# EAGLE design KMO_IO_MV4 (EAGLE 9.1.3)

## Sheet 1 of 2
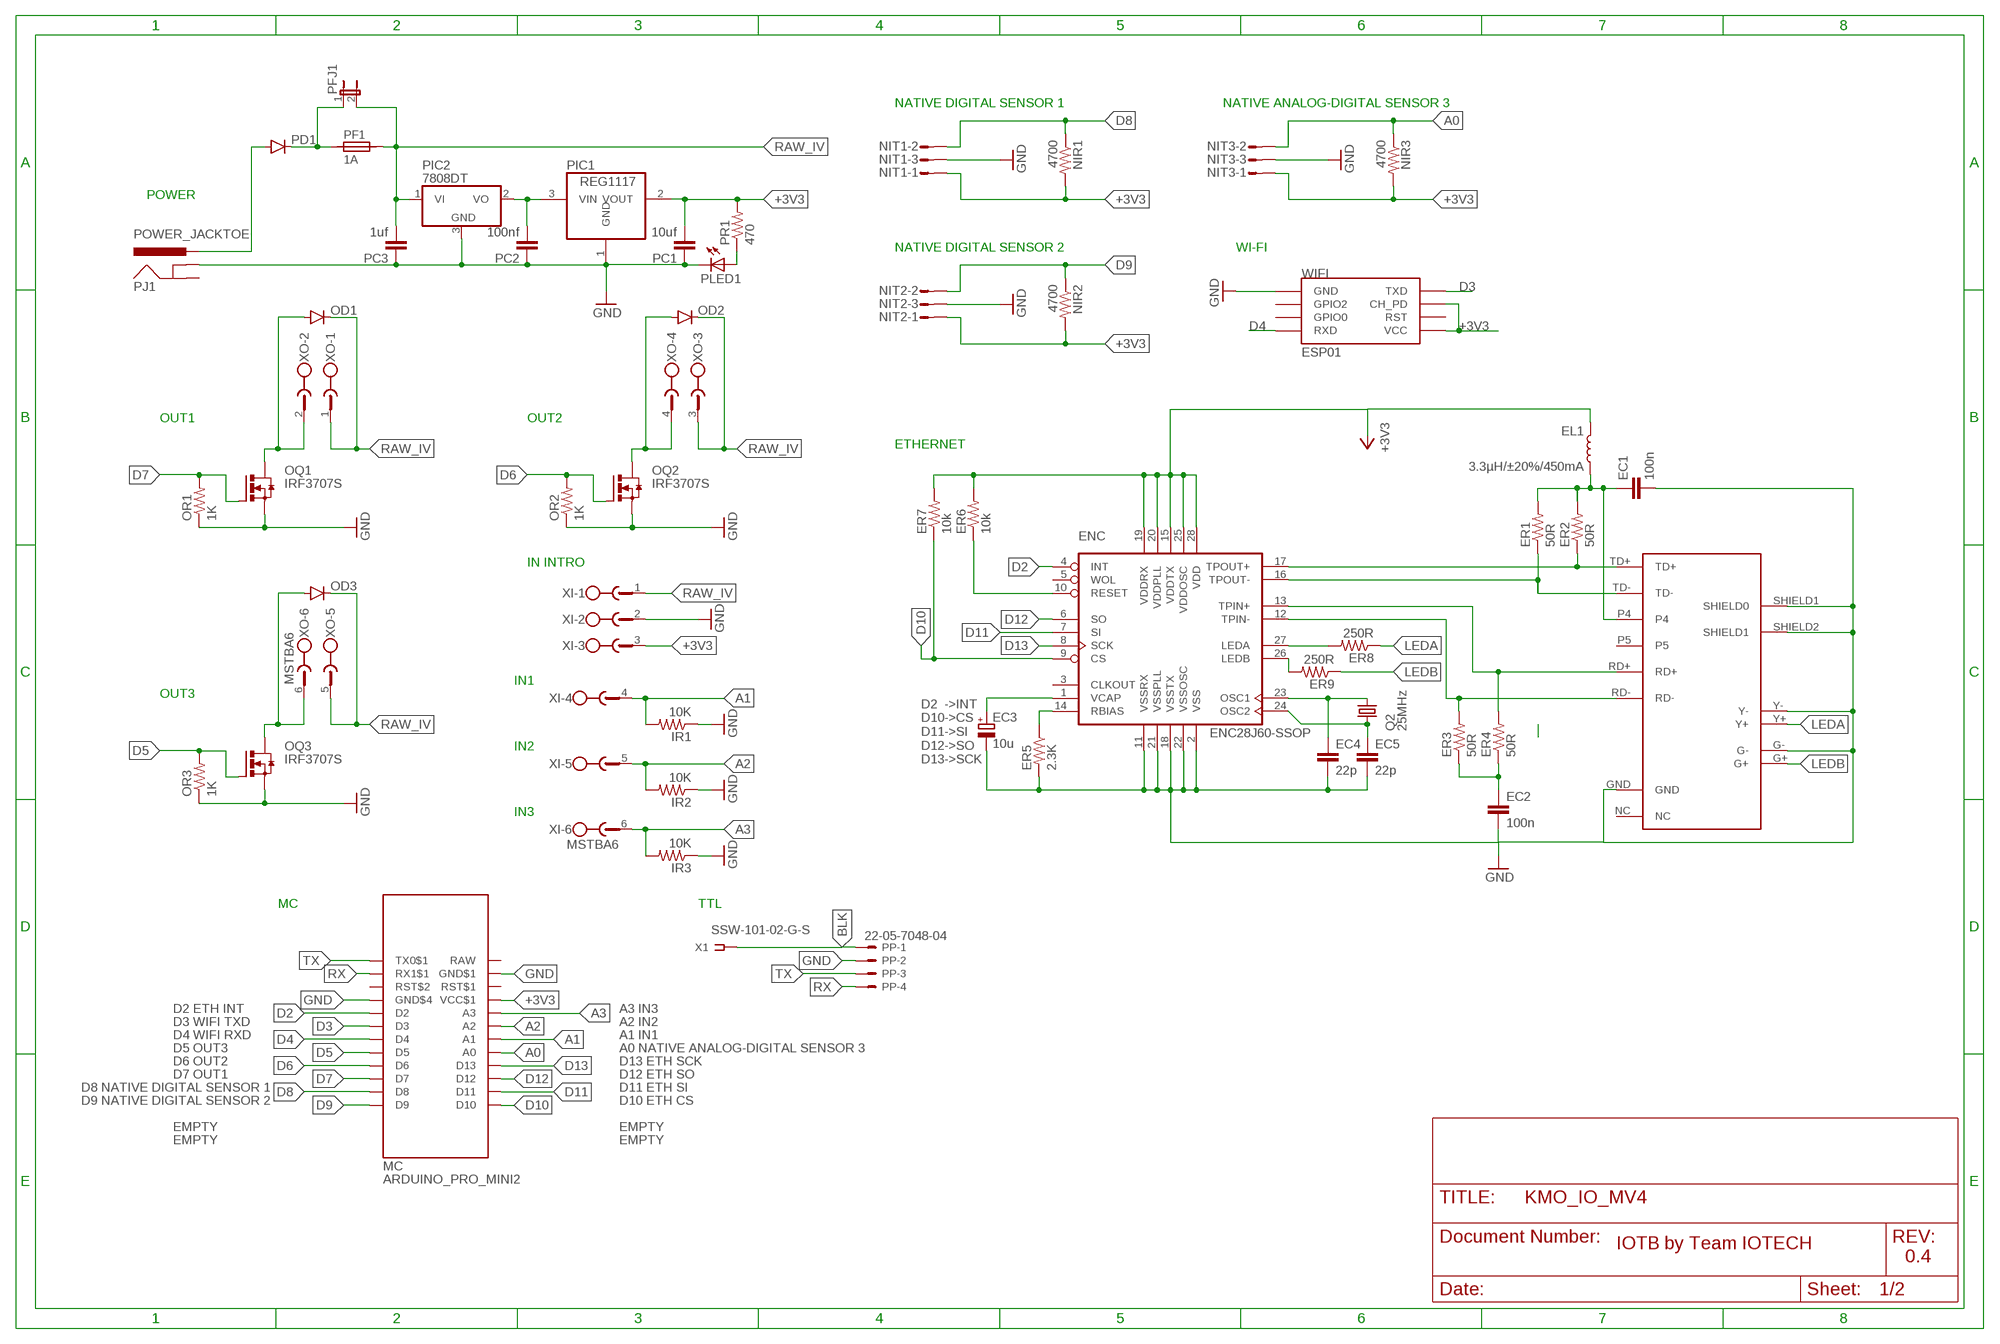
[diagram p0: schematic, sheet 1]

### Parts
EC1  100n  CAP0805  [0805]
EC2  100n  CAP0805  [0805]
EC3  10u  CPOL-EUSANYO_SMD_B6  [SANYO-OSCON_SMD_B6]
EC4  22p  CAP0805  [0805]
EC5  22p  CAP0805  [0805]
EL1  3.3µH/±20%/450mA  INDUCTOR-0805-3.3UH  [0805]
ENC  ENC28J60-SSOP  [SSOP28]
ER1  50R  RESISTOR0805-RES  [0805]
ER2  50R  RESISTOR0805-RES  [0805]
ER3  50R  RESISTOR0805-RES  [0805]
ER4  50R  RESISTOR0805-RES  [0805]
ER5  2.3K  RESISTOR0805-RES  [0805]
ER6  10k  RESISTOR0805-RES  [0805]
ER7  10k  RESISTOR0805-RES  [0805]
ER8  250R  RESISTOR0805-RES  [0805]
ER9  250R  RESISTOR0805-RES  [0805]
IR1  10K  RESISTOR0805-RES  [0805]
IR2  10K  RESISTOR0805-RES  [0805]
IR3  10K  RESISTOR0805-RES  [0805]
MC  ARDUINO_PRO_MINI2  [ARDUINO_PRO_MINI2]
NIR1  4700  RESISTOR0805-RES  [0805]
NIR2  4700  RESISTOR0805-RES  [0805]
NIR3  4700  RESISTOR0805-RES  [0805]
NIT1  S03P  [S03P]
NIT2  S03P  [S03P]
NIT3  S03P  [S03P]
OD1  DIODESMA  [SMA-DIODE]
OD2  DIODESMA  [SMA-DIODE]
OD3  DIODESMA  [SMA-DIODE]
OQ1  IRF3707S  IRF3704S  [D2PACK]
OQ2  IRF3707S  IRF3704S  [D2PACK]
OQ3  IRF3707S  IRF3704S  [D2PACK]
OR1  1K  RESISTOR0805-RES  [0805]
OR2  1K  RESISTOR0805-RES  [0805]
OR3  1K  RESISTOR0805-RES  [0805]
PC1  10uf  CAP0805  [0805]
PC2  100nf  CAP0805  [0805]
PC3  1uf  CAP0805  [0805]
PD1  DIODESMA  [SMA-DIODE]
PF1  1A  SIBA194600  [1820]
PFJ1  JP1E  [JP1]
PIC1  REG1117  [SOT223]
PIC2  7808DT  [TO252]
PJ1  POWER_JACKTOE  [POWER_JACK_SMD_OVERPASTE_TOE]
PLED1  LEDCHIP-LED0805  [CHIP-LED0805]
PP  22-05-7048-04  [7395-04]
PR1  470  RESISTOR0805-RES  [0805]
Q2  25MHz  CRYSTALHC49S  [HC49/S]
U$2  HR911105A  [RJ45]
WIFI  ESP01  [ESP01]
X1  SSW-101-02-G-S  [SSW-101-02-G-S]
XI  MSTBA6  [MSTBA6]
XO  MSTBA6  [MSTBA6]

### Nets
+3V3: EL1.1 ENC.15(VDDTX) ENC.19(VDDRX) ENC.20(VDDPLL) ENC.25(VDDOSC) ENC.28(VDD) ER6.2 ER7.2 MC.VCC$1 NIR1.2 NIR2.2 NIR3.2 NIT1.1 NIT2.1 NIT3.1 PC1.2 PIC1.2(VOUT) PR1.2 WIFI.CH_PD WIFI.VCC XI.3
A0: MC.A0 NIR3.1 NIT3.2
A1: IR1.2 MC.A1 XI.4
A2: IR2.2 MC.A2 XI.5
A3: IR3.2 MC.A3 XI.6
BLK: PP.1 X1.1
D2: ENC.4(INT) MC.D2
D3: MC.D3 WIFI.TX(TXD)
D4: MC.D4 WIFI.RX(RXD)
D5: MC.D5 OQ3.1(G) OR3.2
D6: MC.D6 OQ2.1(G) OR2.2
D7: MC.D7 OQ1.1(G) OR1.2
D8: MC.D8 NIR1.1 NIT1.2
D9: MC.D9 NIR2.1 NIT2.2
D10: ENC.9(CS) ER7.1 MC.D10
D11: ENC.7(SI) MC.D11
D12: ENC.6(SO) MC.D12
D13: ENC.8(SCK) MC.D13
EP4: EC1.1 EL1.2 ER1.2 ER2.2 U$2.P4
GND: EC1.2 EC2.2 EC3.- EC4.2 EC5.2 ENC.2(VSS) ENC.11(VSSRX) ENC.18(VSSTX) ENC.21(VSSPLL) ENC.22(VSSOSC) ER5.2 IR1.1 IR2.1 IR3.1 MC.GDN$1(GND$1) MC.GND$4 NIT1.3 NIT2.3 NIT3.3 OQ1.3(S) OQ2.3(S) OQ3.3(S) OR1.1 OR2.1 OR3.1 PC1.1 PC2.1 PC3.1 PIC1.1(GND) PIC2.3(GND) PJ1.GND(GNDBREAK) PLED1.C PP.2 U$2.G- U$2.GND U$2.SHIELD1(SHIELD0) U$2.SHIELD2(SHIELD1) U$2.Y- WIFI.GND XI.2
LEDA: ER8.1 U$2.Y+
LEDB: ER9.1 U$2.G+
N$1: OD3.A OQ3.2(D) XO.6
N$2: PD1.C PF1.1 PFJ1.1
N$3: OD1.A OQ1.2(D) XO.2
N$4: OD2.A OQ2.2(D) XO.4
N$6: EC2.1 ER3.1 ER4.1
N$7: PD1.A PJ1.VIN0(PWR)
N$9: ENC.27(LEDA) ER8.2
N$11: PLED1.A PR1.1
N$12: PC2.2 PIC1.3(VIN) PIC2.2(VO)
N$13: EC3.+ ENC.1(VCAP)
N$14: ENC.26(LEDB) ER9.2
N$17: ENC.10(RESET) ER6.1
N$19: ENC.14(RBIAS) ER5.1
N$22: EC5.1 ENC.24(OSC2) Q2.1
N$24: EC4.1 ENC.23(OSC1) Q2.2
RAW_IV [v]: OD1.C OD2.C OD3.C PC3.2 PF1.2 PFJ1.2 PIC2.1(VI) XI.1 XO.1 XO.3 XO.5
RD+: ENC.13(TPIN+) ER4.2 U$2.RD+
RD-: ENC.12(TPIN-) ER3.2 U$2.RD-
RX: MC.RX1$1 PP.4
TD+: ENC.17(TPOUT+) ER2.1 U$2.TD+
TD-: ENC.16(TPOUT-) ER1.1 U$2.TD-
TX: MC.TX0$1 PP.3
Unconnected: ENC.3(CLKOUT) ENC.5(WOL) MC.RST$1 MC.RST$2 PJ1.P$4(GND) U$2.NC U$2.P5 WIFI.GPIO0 WIFI.GPIO2 WIFI.RST

### Notes on the sheet
- NATIVE DIGITAL SENSOR 1 | NATIVE ANALOG-DIGITAL SENSOR 3
- POWER
- NATIVE DIGITAL SENSOR 2 | WI-FI
- OUT1 | OUT2
- ETHERNET
- IN INTRO
- IN1
- OUT3
- IN2
- D2  ->INT
  D10->CS
  D11->SI
  D12->SO
  D13->SCK
- IN3
- MC | TTL
- D2 ETH INT | A3 IN3
- D3 WIFI TXD | A2 IN2
- D4 WIFI RXD | A1 IN1
- D5 OUT3 | A0 NATIVE ANALOG-DIGITAL SENSOR 3
- D6 OUT2 | D13 ETH SCK
- D7 OUT1 | D12 ETH SO
- D8 NATIVE DIGITAL SENSOR 1 | D11 ETH SI
- D9 NATIVE DIGITAL SENSOR 2 | D10 ETH CS
- EMPTY | EMPTY
- EMPTY | EMPTY
- IOTB by Team IOTECH
- 0.4

## Sheet 2 of 2
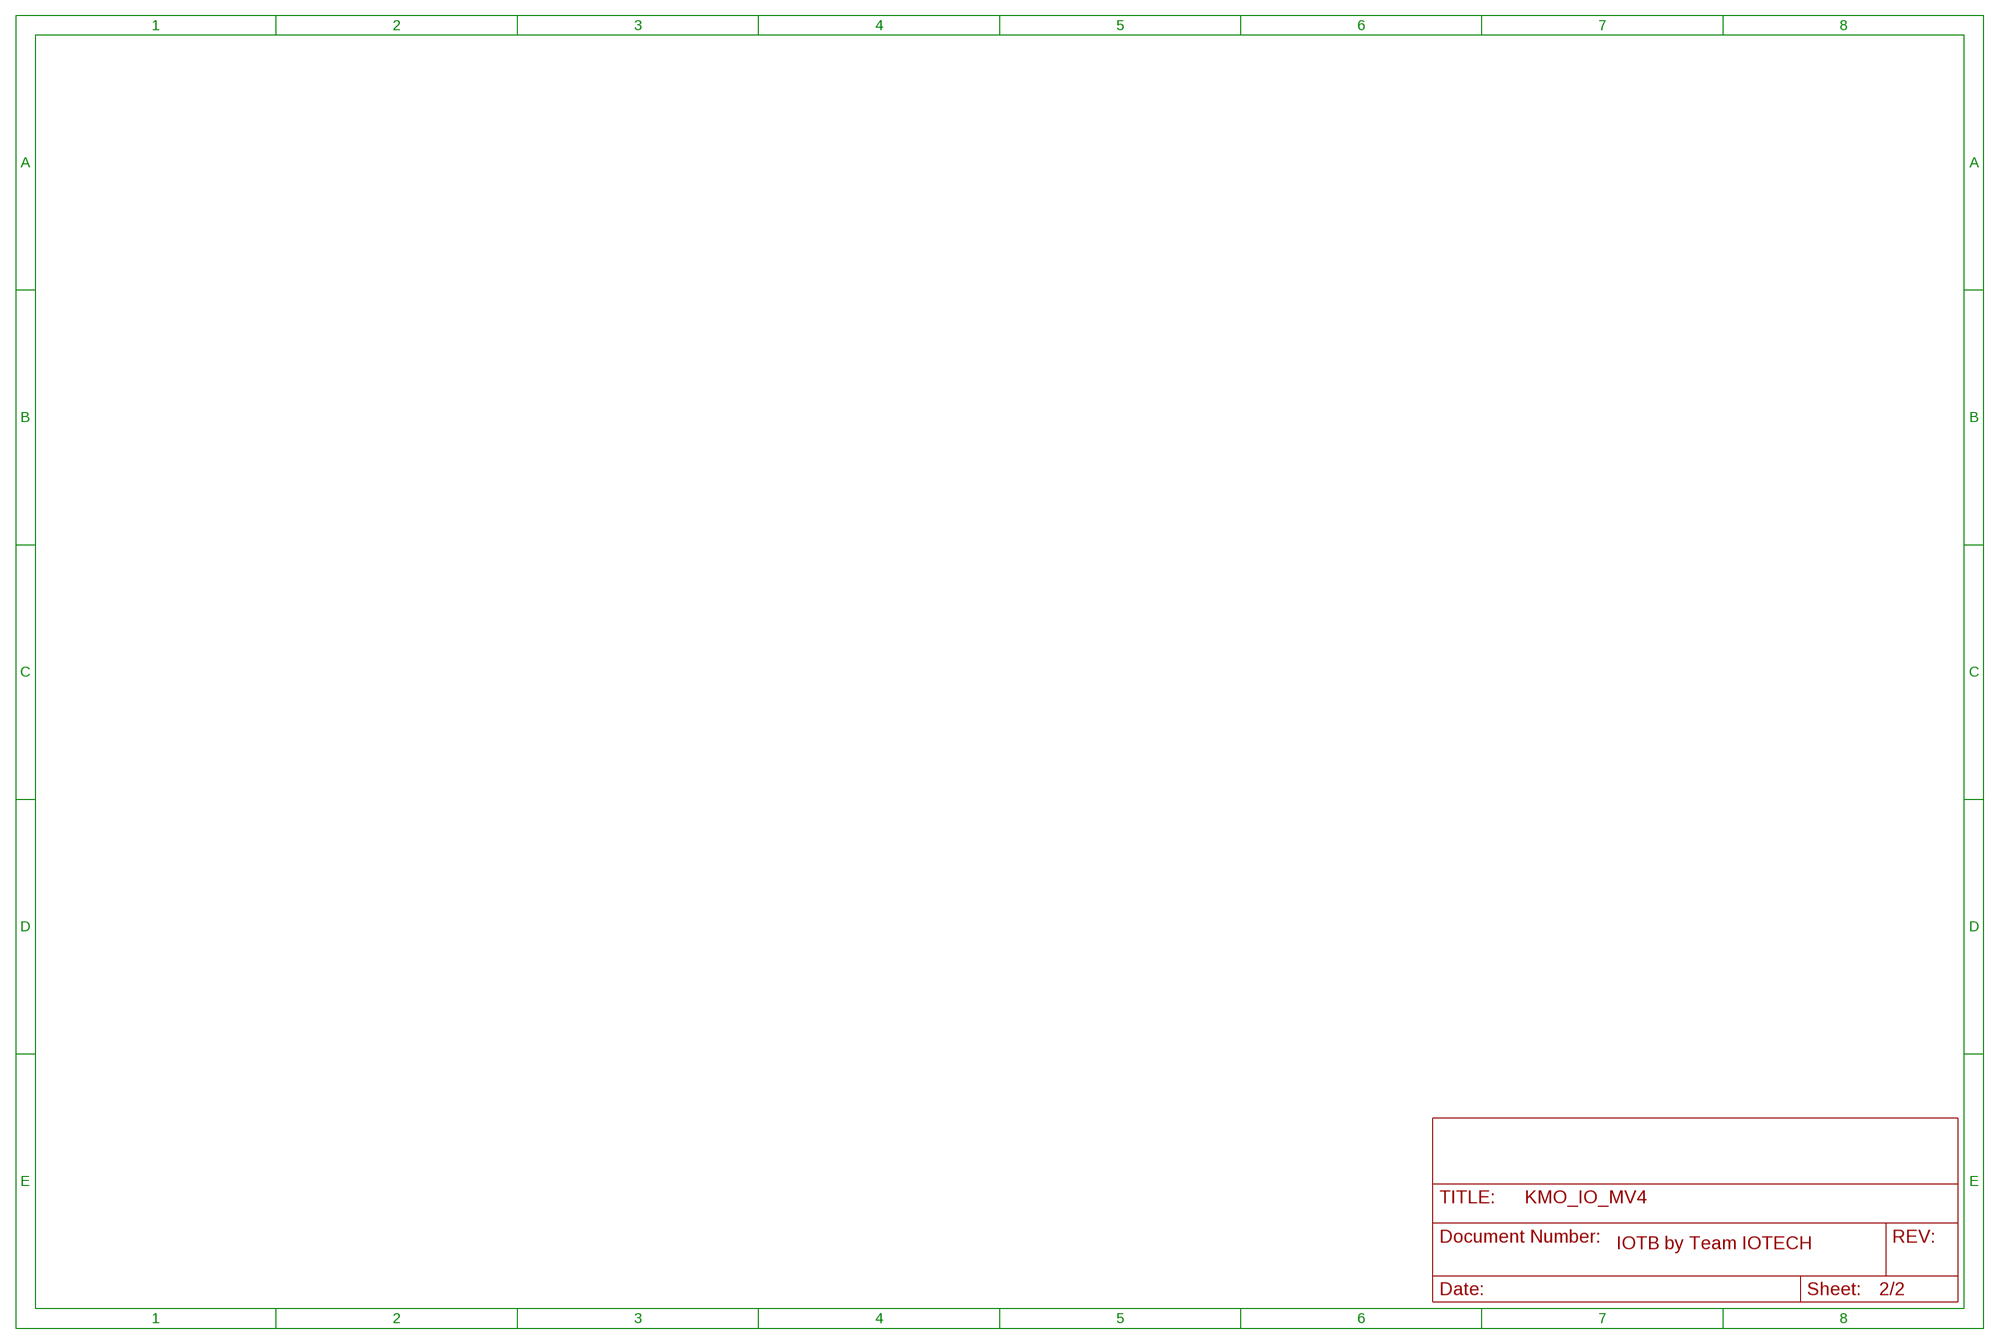
[diagram p1: schematic, sheet 2]

### Notes on the sheet
- IOTB by Team IOTECH

## Power pins joined to a net without a drawn wire
RAW: MC.RAW

## Library data of the parts
EC1 EC2 EC4 EC5 = SparkFun-Passives:CAP: Capacitor Standard 0603 ceramic capacitor, and 0.1" leaded capacitor.
EC3 = rcl:CPOL-EU: POLARIZED CAPACITOR, European symbol; SPICEPREFIX: C
EL1 = SparkFun-Coils:INDUCTOR: Inductors Resist changes in electrical current. Basically a coil of wire. SparkFun Products: SparkFun Load Cell Amplifier - HX711 <https://www.sparkfun.com/products/13879> IOIO-OTG - V2.2 <https://www.sparkfun.com/products/13613>; PROD_ID: NDUC-13076
ENC = microchip-enc28j60:ENC28J60-*: Microchip 10Mbit Eth. contoller with SPI interface
ER1-ER9 IR1-IR3 NIR1-NIR3 OR1-OR3 PR1 = SparkFun-Passives:RESISTOR: Resistor Basic schematic elements and footprints for 0603, 1206, and PTH resistors.
MC = personal_srgPersonal:ARDUINO_PRO_MINI2
NIT1-NIT3 = con-amp-mt:S03P: AMP MT CONNECTOR; OC_FARNELL: unknown; OC_NEWARK: unknown
OD1-OD3 PD1 = SparkFun-DiscreteSemi:DIODE: Diode These are standard reverse protection diodes and small signal diodes. SMA package can handle up to about 1A. SOD-323 can handle about 200mA. What the SOD-323 package when ordering, there are some mfgs out there that are 5-pin packages.
OQ1-OQ3 = transistor-power:IRF3704: SMPS MOSFET HEXFET® Power MOSFET Source: http://www.irf.com/product-info/datasheets/data/irf3704.pdf
PC1-PC3 = SparkFun-Capacitors:CAP: Capacitor Standard 0603 ceramic capacitor, and 0.1" leaded capacitor.
PF1 = _hhn_PtcFuses_Siba_r500_Ozan:SIBA194600*: SIBA PTC-Fuses, Series 194600, 1812 (4.5 3.2)mm Source: www.siba.de/ Package: SMD 1812 (4.5 x 3.2)mm Technologies: SIBA194600Axxx xxx: Trip-Current * 10 mA Author: Dipl.-Ing. FH Rainer Bayer
PFJ1 = jumper:JP1E: JUMPER
PIC1 = burr-brown:REG1117: 800mA and 1A Low Dropout (LDO) Positive Regulator 1.8V, 2.5V, 2.85V, 3.3V, 5V, and Adj; MPN: REG1117; OC_FARNELL: 1097566; OC_NEWARK: 14P6981
PIC2 = linear:78*: Positive VOLTAGE REGULATOR Source: http://cache.national.com/ds/LM/LM78L05.pdf http://www.fairchildsemi.com/ds/LM/LM7805.pdf
PJ1 = SparkFun-Connectors:POWER_JACK: Power Jack Connector This is the standard 5.5mm barrel jack for power. The PTH is the most common, proven, reliable, footprint. The Slot footprint only works if the mill layer is transmitted to the PCB fab house so be warned. Here are the connectors we sell at SparkFun: DC Barrel Power Jack/Connector <https://www.sparkfun.com/products/119> (PRT-00119) DC Barrel Power Jack/Connector (SMD) <https://www.sparkfun.com/products/12748> (PRT-12748) DC Barrel Jack Adapter - Breadboard Compatible <https://www.sparkfun.com/products/10811> (PRT-10811) It is used on this SparkFun product (and many, many others): SparkFun RedBoard - Programmed with Arduino <https://www.sparkfun.com/products/12757> (DEV-12757) Also, if you need a mating power supply or connector, please check these out: Wall Adapter Power Supply - 9VDC 650mA <https://www.sparkfun.com/products/298> (TOL-00298) DC Barrel Jack Adapter - Male <https://www.sparkfun.com/products/10287> (PRT-10287); PROD_ID: CONN-08106; SF_ID: PRT-12748
PLED1 = led:LED: LED OSRAM: - CHIPLED LG R971, LG N971, LY N971, LG Q971, LY Q971, LO R971, LY R971 LH N974, LH R974 LS Q976, LO Q976, LY Q976 LO Q996 - Hyper CHIPLED LW Q18S LB Q993, LB Q99A, LB R99A - SideLED LS A670, LO A670, LY A670, LG A670, LP A670 LB A673, LV A673, LT A673, LW A673 LH A674 LY A675 LS A676, LA A676, LO A676, LY A676, LW A676 LS A679, LY A679, LG A679 - Hyper Micro SIDELED® LS Y876, LA Y876, LO Y876, LY Y876 LT Y87S - SmartLED LW L88C, LW L88S LB L89C, LB L89S, LG L890 LS L89K, LO L89K, LY L89K LS L896, LA L896, LO L896, LY L896 - TOPLED LS T670, LO T670, LY T670, LG T670, LP T670 LSG T670, LSP T670, LSY T670, LOP T670, LYG T670 LG T671, LOG T671, LSG T671 LB T673, LV T673, LT T673, LW T673 LH T674 LS T676, LA T676, LO T676, LY T676, LB T676, LH T676, LSB T676, LW T676 LB T67C, LV T67C, LT T67C, LS T67K, LO T67K, LY T67K, LW E67C LS E67B, LA E67B, LO E67B, LY E67B, LB E67C, LV E67C, LT E67C LW T67C LS T679, LY T679, LG T679 LS T770, LO T770, LY T770, LG T770, LP T770 LB T773, LV T773, LT T773, LW T773 LH T774 LS E675, LA E675, LY E675, LS T675 LS T776, LA T776, LO T776, LY T776, LB T776 LHGB T686 LT T68C, LB T68C - Hyper Mini TOPLED® LB M676 - Mini TOPLED Santana® LG M470 LS M47K, LO M47K, LY M47K Source: http://www.osram.convergy.de LUXEON: - LUMILED® LXK2-PW12-R00, LXK2-PW12-S00, LXK2-PW14-U00, LXK2-PW14-V00 LXK2-PM12-R00, LXK2-PM12-S00, LXK2-PM14-U00 LXK2-PE12-Q00, LXK2-PE12-R00, LXK2-PE12-S00, LXK2-PE14-T00, LXK2-PE14-U00 LXK2-PB12-K00, LXK2-PB12-L00, LXK2-PB12-M00, LXK2-PB14-N00, LXK2-PB14-P00, LXK2-PB14-Q00 LXK2-PR12-L00, LXK2-PR12-M00, LXK2-PR14-Q00, LXK2-PR14-R00 LXK2-PD12-Q00, LXK2-PD12-R00, LXK2-PD12-S00 LXK2-PH12-R00, LXK2-PH12-S00 LXK2-PL12-P00, LXK2-PL12-Q00, LXK2-PL12-R00 Source: www.luxeon.com KINGBRIGHT: KA-3528ASYC Source: www.kingbright.com
PP = con-molex:22-?-04: CONNECTOR wire to board 2.54 mm (.1 inch) pitch header; MF: MOLEX; OC_FARNELL: unknown; OC_NEWARK: unknown
Q2 = crystal:CRYSTAL: CRYSTAL
U$2 = HR911105A:HR911105A
WIFI = esp8266modules:ESP01: ESP8266 Wifi module 01
X1 = con-samtec:SSW-101-02-G-S: THROUGH-HOLE .025" SQ POST SOCKET Source: Samtec SSW.pdf; MF: Samtec Inc.; MPN: SSW-101-02-G-S; OC_FARNELL: unknown; OC_NEWARK: 11P9336
XI XO = con-phoenix-508:MSTBA6: PHOENIX; MF: FARNELL; MPN: 1757284; OC_FARNELL: 3705213; OC_NEWARK: 71C4165

## Net classes
0 default: width 0.3 mm, drill 0.5 mm, clearance 0.25 mm
1 v: width 0.3 mm, drill 0.5 mm, clearance 0.25 mm

## Board
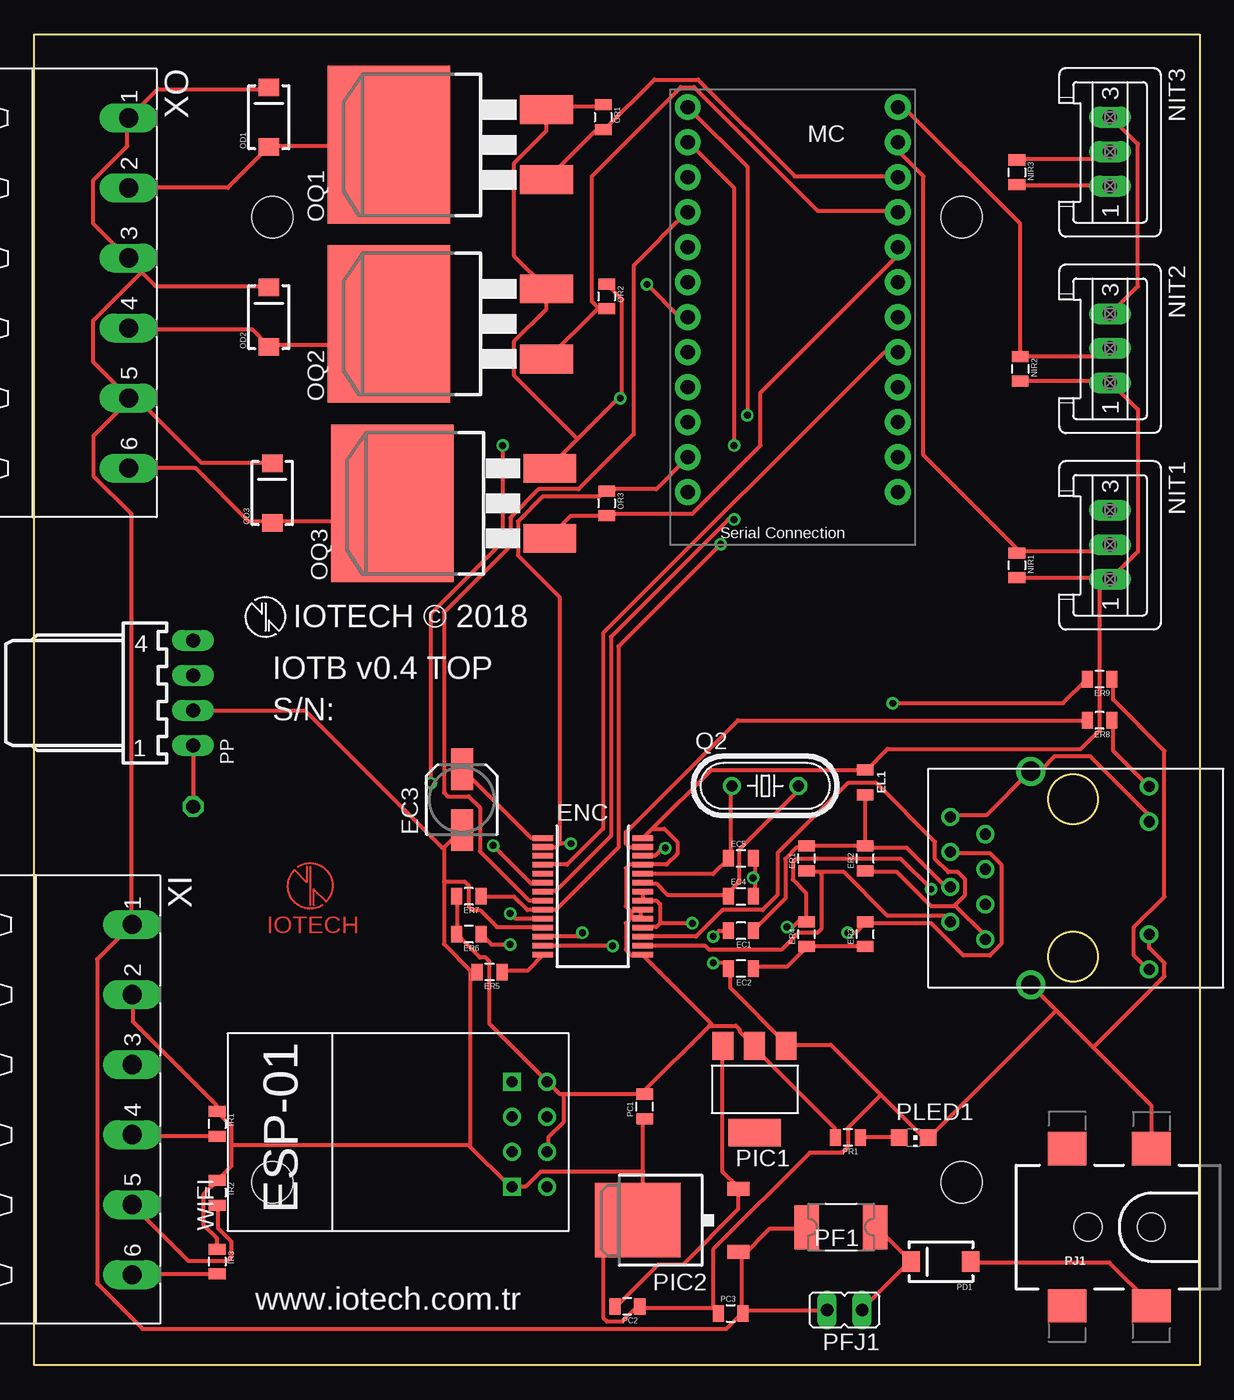
[diagram p2: board, top side]
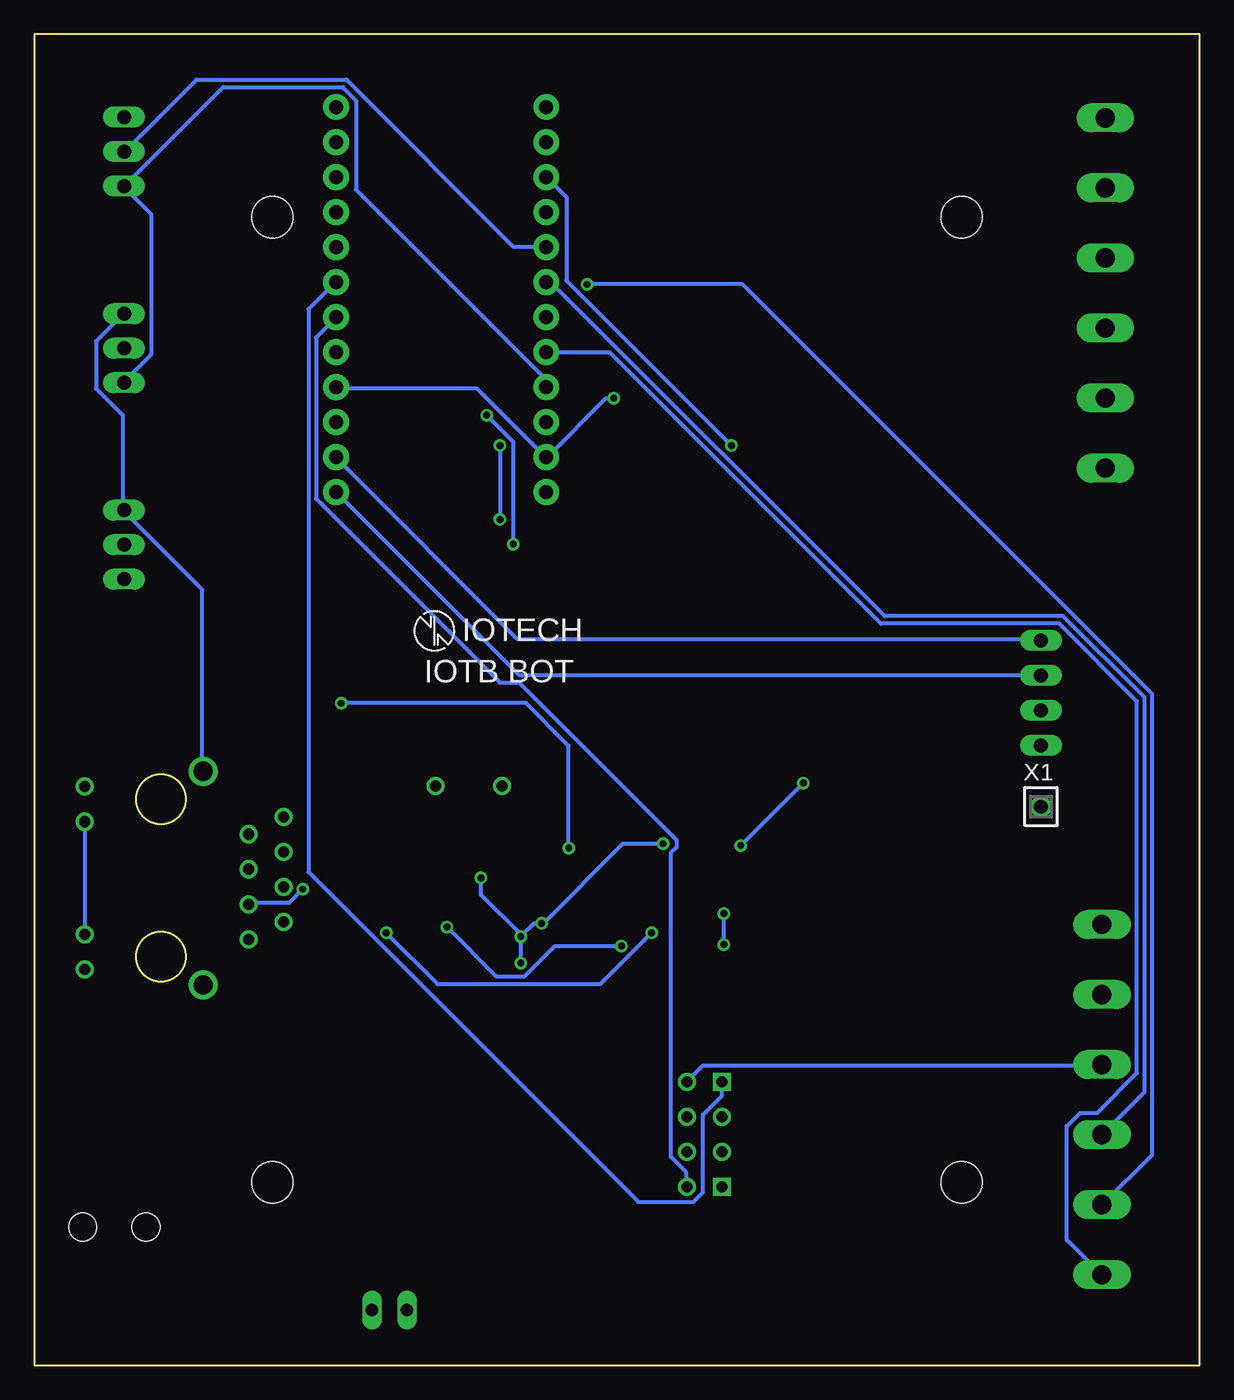
[diagram p3: board, bottom side, seen from below]

Size 84.5 x 96.5 mm. Coordinates in mm from the lower left corner, seen from the top.
Outline: 0,0 0,96.5 84.5,96.5 84.5,0 0,0
Copper layers (1*16): Top 0.035mm / dielectric 1.5mm / Bottom 0.035mm
Design rules "KMO_IO_M": minimum track width 6mil, minimum drill 0.35mm, track to track 0.205mm, track to pad 0.205mm, pad to pad 0.205mm, via to via 0.205mm, smd to smd 6mil, copper to edge 40mil, drill to drill 6mil, minimum pad ring 10mil, minimum via ring 8mil, stop-mask expansion 4mil, vias tented up to drill 0mil, thermal gap 10mil
Holes 3 mm at 17.25,83.25 67.25,83.25 17.25,13.25 67.25,13.25

### Footprints (pad centres in the part's own frame; a part is rotated, then mirrored left to right if it is on the bottom)
0805 = smd 0.8 x 1.2: 1 -0.9,0; 2 0.9,0
SANYO-OSCON_SMD_B6 = smd 3 x 1.6: + 2.2,0; - -2.2,0
SSOP28 = smd 0.4 x 1.5: 1 -4.225,-3.625; 2 -3.575,-3.625; 3 -2.925,-3.625; 4 -2.275,-3.625; 5 -1.625,-3.625; 6 -0.975,-3.625; 7 -0.325,-3.625; 8 0.325,-3.625; 9 0.975,-3.625; 10 1.625,-3.625; 11 2.275,-3.625; 12 2.925,-3.625; 13 3.575,-3.625; 14 4.225,-3.625; 15 4.225,3.625; 16 3.575,3.625; 17 2.925,3.625; 18 2.275,3.625; 19 1.625,3.625; 20 0.975,3.625; 21 0.325,3.625; 22 -0.325,3.625; 23 -0.975,3.625; 24 -1.625,3.625; 25 -2.275,3.625; 26 -2.925,3.625; 27 -3.575,3.625; 28 -4.225,3.625
ARDUINO_PRO_MINI2 = drill 1.016 pad 1.88: A0 7.62,-5.08; A1 7.62,-2.54; A2 7.62,0; A3 7.62,2.54; D2 -7.62,2.54; D3 -7.62,0; D4 -7.62,-2.54; D5 -7.62,-5.08; D6 -7.62,-7.62; D7 -7.62,-10.16; D8 -7.62,-12.7; D9 -7.62,-15.24; D10 7.62,-15.24; D11 7.62,-12.7; D12 7.62,-10.16; D13 7.62,-7.62; GDN$1 7.62,10.16; GND$4 -7.62,5.08; RAW 7.62,12.7; RST$1 7.62,7.62; RST$2 -7.62,7.62; RX1$1 -7.62,10.16; TX0$1 -7.62,12.7; VCC$1 7.62,5.08
S03P = drill 1.016 long: 1 2.5,0; 2 0,0; 3 -2.5,0
SMA-DIODE = smd 1.27 x 1.47: A -2.15,0; C 2.15,0
D2PACK = smd 2.083 x 3.81: 1 -2.54,-8.89; 3 2.54,-8.89 | smd 11.43 x 8.89: 2 0,2.54
1820 = smd 1.78 x 3.2: 1 -2.49,0; 2 2.49,0
JP1 = drill 0.914 long: 1 0,-1.27; 2 0,1.27
SOT223 = smd 1.499 x 2.007: 1 -2.261,-3.15; 2 0.025,-3.15; 3 2.311,-3.15 | smd 3.81 x 2.007: 4 0,3.15
TO252 = smd 1 x 1.6: 1 -2.28,-4.8; 2 2.28,-4.8 | smd 5.4 x 6.2: 3 0,2.5
POWER_JACK_SMD_OVERPASTE_TOE = smd 2.8 x 2.4: GND 0,-5.7; P$4 6.1,-5.7; VIN0 0,5.7; VIN1 6.1,5.7 | hole 2.032: 0,0; 4.572,0
CHIP-LED0805 = smd 1.2 x 1.2: A 0,-1.05; C 0,1.05
7395-04 = drill 1.016 long: 1 3.81,0; 2 1.27,0; 3 -1.27,0; 4 -3.81,0
HC49/S = drill 0.813: 1 -2.413,0; 2 2.413,0
RJ45 = drill 0.8: G+ 5.84,-6.305; G- 5.84,-3.765; GND -8.57,4.76; NC -6.03,3.5; P4 -8.57,-0.32; P5 -6.03,0.96; RD+ -6.03,-1.58; RD- -8.57,2.22; TD+ -6.03,-4.12; TD- -8.57,-2.86; Y+ 5.84,6.945; Y- 5.84,4.405 | drill 1.4: SHIELD1 -2.73,-7.425; SHIELD2 -2.73,8.065
ESP01 = drill 0.8: CH_PD -1.285,-8.178; GPIO0 1.255,-5.638; GPIO2 -1.285,-5.638; RST 1.255,-8.178; TX -3.825,-8.178; VCC 3.795,-8.178 | drill 0.8 square: GND -3.825,-5.638; RX 3.795,-5.638
SSW-101-02-G-S = drill 1 pad 1.5 octagon: 1 0,0
MSTBA6 = drill 1.397 long: 1 -12.7,5.08; 2 -7.62,5.08; 3 -2.54,5.08; 4 2.54,5.08; 5 7.62,5.08; 6 12.7,5.08

### Placement (x,y rotation side)
EC1  51.25,31.5 180 top
EC2  51.25,28.75 180 top
EC3  31,41 90 top
EC4  51.25,34 0 top
EC5  51.25,36.75 0 top
EL1  60.25,42.25 270 top
ENC  40.5,34 270 top
ER1  56,36.75 90 top
ER2  60.25,36.75 90 top
ER3  60.25,31.25 90 top
ER4  56,31.25 90 top
ER5  33,28.5 180 top
ER6  31.5,31.25 180 top
ER7  31.5,34 180 top
ER8  77.25,46.75 180 top
ER9  77.25,49.75 180 top
IR1  13.25,17.5 270 top
IR2  13.25,12.5 270 top
IR3  13.25,7.5 270 top
MC  55,76 180 top
NIR1  71.25,58 270 top
NIR2  71.5,72.25 270 top
NIR3  71.25,86.5 270 top
NIT1  78,59.5 270 top
NIT2  78,73.75 270 top
NIT3  78,88 270 top
OD1  17,90.5 90 top
OD2  17,76 90 top
OD3  17.25,63.25 90 top
OQ1  28.25,88.5 90 top
OQ2  28.25,75.5 90 top
OQ3  28.5,62.5 90 top
OR1  41.25,90.5 270 top
OR2  41.5,77.5 270 top
OR3  41.5,62.5 270 top
PC1  44.25,18.75 90 top
PC2  43,4.25 180 top
PC3  50.5,3.75 0 top
PD1  65.75,7.5 180 top
PF1  58.5,10 180 top
PFJ1  58.75,4 90 top
PIC1  52.25,20 180 top
PIC2  46.25,10.5 90 top
PJ1  81,10 180 top
PLED1  63.75,16.5 270 top
PP  11.5,48.75 270 top
PR1  59,16.5 180 top
Q2  53,42 0 top
U$1  [IOTECH_COPPER_W_TEXT]  20,34.75 0 top
U$2  75,35 0 top
WIFI  29,16.75 90 top
X1  11.5,40.5 270 bottom
XI  2,19.25 270 top
XO  1.75,77.75 270 top

### Tracks (layer width: path | path; a pad name or v marks a point on that pad's centre or on a via)
+3V3
  Top 0.3: NIR1.2 71.36,57.06 77.96,57.06 NIT1.1 | NIR2.2 71.5,71.36 77.96,71.36 NIT2.1 78.1,71.22 80.03,69.3 80.03,58.99 78.1,57.06 NIT1.1 | NIR3.2 71.36,85.53 77.96,85.53 NIT3.1 | 43.31,32.45 42.9,32.04 42.9,30.11 43.31,29.7 44,29.7 ENC.15 44.14,29.7 49.09,24.75 49.09,24.61 | 44,32.45 43.31,32.45 | 44,32.45 ENC.19 | ENC.20 44,33 44,32.59 44,32.45 | 44.8,38.89 49.09,43.17 60.23,43.17 EL1.1 60.36,43.17 61.88,44.69 75.9,44.69 77.28,46.06 77.28,56.92 NIT1.1 | ENC.28 44.14,38.23 44.62,38.71 44.8,38.89 | 43.31,32.45 43.31,32.59 43.31,32.86 42.9,33.27 42.9,36.02 43.17,36.3 44,36.3 ENC.25 44.14,36.3 45.85,36.3 46.62,37.08 46.62,37.95 45.69,38.89 44.8,38.89 | PR1.2 58.02,16.5 58.02,17.19 52.11,23.1 PIC1.2 52.11,23.24 51.15,24.2 51.15,24.34 50.88,24.61 49.09,24.61 | ER7.2 30.66,33.96 30.66,31.35 ER6.2 30.66,31.21 32.31,29.56 32.73,29.56 33,29.29 33,24.75 37.12,20.62 WIFI.VCC 37.26,20.49 38.09,19.66 38.36,19.66 | 38.36,19.66 44.14,19.66 PC1.2 44.14,19.8 48.95,24.61 49.09,24.61 | WIFI.CH_PD 37.26,15.54 37.26,16.5 38.36,17.6 38.36,19.52 38.36,19.66
  Bottom 0.3: MC.VCC$1 47.44,70.95 47.44,71.5 61.19,85.25 61.19,91.71 62.15,92.67 70.81,92.67 77.96,85.53 NIT3.1 77.96,85.39 76.04,83.46 76.04,73.29 77.96,71.36 NIT2.1 | XI.3 7.15,21.73 36.02,21.73 37.12,20.62 WIFI.VCC
A0
  Top 0.3: NIR3.1 71.36,87.45 77.41,87.45 77.96,88 NIT3.2
  Bottom 0.3: MC.A0 47.44,81.12 49.77,81.12 61.88,93.22 72.74,93.22 77.96,88 NIT3.2
A1
  Top 0.3: IR1.2 13.2,16.64 7.15,16.64 XI.4
  Bottom 0.3: MC.A1 47.3,78.51 47.02,78.51 22.82,54.31 9.9,54.31 3.99,48.4 3.99,19.8 7.01,16.77 XI.4
A2  (via drill 0.5)
  Top 0.3: IR2.2 13.34,11.55 13.34,9.9 14.3,8.94 14.3,7.84 14.03,7.56 11.14,7.56 7.15,11.55 XI.5 | v44.41,78.38 46.75,76.04 47.3,76.04 MC.A2
  Bottom 0.3: v44.41,78.38 33.14,78.38 3.44,48.67 3.44,15.26 7.01,11.69 XI.5
A3
  Top 0.3: IR3.2 13.2,6.6 7.15,6.6 XI.6
  Bottom 0.3: MC.A3 47.3,73.42 42.76,73.42 23.1,53.76 10.18,53.76 4.54,48.12 4.54,21.18 7.42,18.29 8.66,18.29 9.62,17.32 9.62,9.07 7.15,6.6 XI.6
BLK
  Top 0.3: PP.1 X1.1
D2
  Top 0.3: ENC.4 36.99,36.3 38.64,36.3 41.25,38.91 41.25,53.08 61.6,73.42 62.56,73.42 MC.D2
D3
  Bottom 0.3: WIFI.TX 37.26,12.93 37.26,14.03 38.36,15.12 38.36,37.12 37.95,37.54 37.95,38.09 49.36,49.5 50.74,49.5 64.08,62.84 64.08,74.53 62.7,75.9 MC.D3
D4
  Bottom 0.3: WIFI.RX 34.65,20.49 34.65,19.52 36.02,18.15 36.02,12.51 36.71,11.82 40.7,11.82 64.62,35.75 64.62,76.59 62.7,78.51 MC.D4
D5
  Top 0.3: OQ3.1 37.4,60.09 38.91,61.6 41.39,61.6 OR3.2 41.52,61.74 47.71,61.74 52.66,66.69 52.66,70.54 62.56,80.44 62.56,80.99 MC.D5
D6
  Top 0.3: 40.84,76.59 41.39,76.59 OR2.2 | 40.84,76.59 37.26,73.01 OQ2.1 | MC.D6 62.56,83.74 56.79,83.74 47.85,92.67 46.89,92.67 40.42,86.21 40.42,77.14 40.84,76.72 40.84,76.59
D7
  Top 0.3: OQ1.1 37.26,86.08 40.7,89.51 41.25,89.51 OR1.2 41.39,89.65 44.96,93.22 48.12,93.22 55.14,86.21 62.56,86.21 MC.D7
D8
  Top 0.3: NIT1.2 77.96,59.4 77.55,58.99 71.36,58.99 NIR1.1 71.36,59.12 64.49,66 64.49,86.21 62.7,88 62.7,88.69 MC.D8
D9
  Top 0.3: NIT2.2 77.96,73.7 77.41,73.15 NIR2.1 71.5,73.29 71.5,82.78 63.11,91.16 62.7,91.16 MC.D9
D10  (via drill 0.5)
  Top 0.3: ER7.1 32.45,33.96 34.79,33.96 35.75,33 36.85,33 ENC.9 36.99,33 37.81,33 42.35,37.54 42.35,52.11 v49.77,59.54 | v51.7,68.89 51.7,86.9 47.44,91.16 MC.D10
  Bottom 0.3: v49.77,59.54 49.77,66.96 v51.7,68.89
D11  (via drill 0.5)
  Top 0.3: v50.74,61.33 50.33,61.33 41.8,52.8 41.8,38.36 37.81,34.38 36.99,34.38 ENC.7 | v50.74,66.69 50.74,85.39 47.44,88.69 MC.D11
  Bottom 0.3: v50.74,66.69 v50.74,61.33
D12  (via drill 0.5)
  Top 0.3: v33.27,37.67 36.02,34.92 36.85,34.92 ENC.6 | v28.74,42.21 28.74,54.45 33.96,59.67 v33.96,66.69
  Bottom 0.3: v28.74,42.21 v33.27,37.67 | v33.96,66.69 45.92,78.65 45.92,84.7 47.3,86.08 MC.D12
D13
  Top 0.3: ENC.8 36.85,33.69 35.89,33.69 32.31,37.26 32.31,40.42 31.49,41.25 29.98,41.25 29.7,41.52 29.7,54.59 34.51,59.4 34.51,61.46 36.58,63.52 39.46,63.52 43.45,67.51 43.45,79.75 47.3,83.6 MC.D13
EP4
  Top 0.3: ER2.2 60.23,37.67 60.23,41.25 EL1.2 | EC1.1 52.25,31.62 54.45,33.83 54.45,36.71 55.27,37.54 55.96,37.54 ER1.2 56.1,37.67 60.09,37.67 ER2.2 | U$2.P4 66.41,34.79 66,34.79 63.25,37.54 60.36,37.54 ER2.2
GND  (via drill 0.5)
  Top 0.3: 31.62,28.6 32.04,28.6 ER5.2 | 31.62,28.6 29.7,30.52 29.7,35.06 | 29.7,37.54 29.7,35.06 | 29.7,37.54 30.94,38.77 EC3.- | ENC.11 36.85,31.76 33.55,31.76 32.31,33 31.76,33 31.49,33.27 31.49,34.79 31.21,35.06 29.84,35.06 29.7,35.06 | PP.2 11.55,47.44 19.66,47.44 29.56,37.54 29.7,37.54 | IR3.1 13.2,8.53 13.2,9.21 12.24,10.18 12.24,12.38 13.2,13.34 IR2.1 13.34,13.47 14.3,14.44 14.3,15.95 | 14.3,15.95 14.3,17.32 13.34,18.29 IR1.1 13.2,18.43 13.2,18.84 7.15,24.89 7.15,26.81 XI.2 | 44.14,14.03 44.14,10.86 43.86,10.59 PIC2.3 43.73,10.45 41.25,7.97 41.25,3.44 41.52,3.16 42.62,3.16 43.59,4.12 43.86,4.12 PC2.1 44,4.12 49.23,4.12 49.5,3.85 PC3.1 49.23,4.26 49.23,8.39 56.24,15.4 58.58,15.4 58.99,15.81 58.99,17.19 61.33,19.52 61.39,19.59 | 44.14,14.03 44.14,17.74 PC1.1 | 44.14,14.03 44,14.03 36.71,14.03 35.61,12.93 WIFI.GND 34.51,12.93 31.49,15.95 | 31.49,15.95 14.44,15.95 14.3,15.95 | 31.62,28.6 31.62,28.46 31.62,15.95 31.49,15.95 | OR1.1 41.25,91.3 37.4,91.3 37.26,91.16 OQ1.3 37.12,91.03 37.12,89.51 34.79,87.17 34.79,80.44 37.12,78.1 OQ2.3 37.12,77.96 37.12,76.59 34.79,74.25 34.79,71.78 39.33,67.24 39.39,67.17 | 39.39,67.17 37.4,65.17 OQ3.3 | 39.39,67.17 42.42,70.19 | 42.42,70.19 42.62,70.4 42.62,77.28 41.52,78.38 OR2.1 | MC.GDN$1 47.3,65.72 45.1,63.52 41.52,63.52 OR3.1 41.39,63.39 40.98,62.98 36.85,62.98 35.06,61.19 35.06,58.71 38.09,55.69 38.09,37.81 | 38.09,37.81 37.81,37.54 36.99,37.54 ENC.2 | v42.49,70.12 42.42,70.19 | 45.38,32.04 45.1,31.76 44.14,31.76 ENC.18 | 45.38,32.04 45.38,33.41 45.1,33.69 44.14,33.69 ENC.21 44.14,33.83 44.14,34.24 ENC.22 | 52.25,35.34 52.25,36.71 EC5.2
  Top 0.3: 52.25,35.34 52.25,34.1 EC4.2 | v49.23,31.07 49.64,31.49 50.33,31.49 EC1.2 | v49.23,29.15 50.05,29.15 50.33,28.88 EC2.2 50.46,28.74 50.46,27.36 54.59,23.24 PIC1.1 54.73,23.24 57.75,23.24 61.39,19.59 | 61.39,19.59 64.49,16.5 64.76,16.5 PLED1.C 64.9,16.5 74.11,25.71 | v52.11,35.34 52.25,35.34 | v47.71,32.04 45.51,32.04 45.38,32.04 | NIT3.3 78.1,90.47 80.03,88.55 80.03,78.24 78.1,76.31 NIT2.3 | U$2.GND 66.55,39.88 69.03,39.88 72.19,43.04 U$2.SHIELD2 72.33,43.17 73.01,43.17 73.97,44.14 76.59,44.14 80.71,40.01 80.71,39.46 U$2.Y- | 74.11,25.71 72.33,27.5 U$2.SHIELD1 | 74.11,25.71 76.79,23.03 | 76.79,23.03 80.99,18.84 80.99,15.81 PJ1.GND | U$2.G- 80.85,31.21 80.85,30.25 81.95,29.15 81.95,28.19 76.86,23.1 76.79,23.03 | v38.91,37.81 38.23,37.81 38.09,37.81
  Bottom 0.3: MC.GND$4 62.56,70.81 52.39,70.81 47.44,65.86 MC.GDN$1 47.3,65.86 43.04,70.12 v42.49,70.12 | v49.23,29.15 v49.23,31.07 | v52.11,35.34 52.11,34.1 49.23,31.21 v49.23,31.07 | v49.23,31.07 49.09,31.21 48.26,32.04 v47.71,32.04 47.58,32.04 41.8,37.81 v38.91,37.81 | NIT2.3 78.1,76.17 80.03,74.25 80.03,70.81 78.1,68.89 78.1,62.01 NIT1.3 77.96,61.88 72.33,56.24 72.33,43.17 U$2.SHIELD2 | U$2.G- 80.85,31.35 80.85,39.33 U$2.Y-
LEDA
  Top 0.3: ER8.1 78.24,46.75 78.24,44.55 80.71,42.08 U$2.Y+
LEDB
  Top 0.3: ER9.1 78.24,49.64 78.24,48.26 81.95,44.55 81.95,33.96 79.75,31.76 79.75,29.7 80.71,28.74 U$2.G+
N$1
  Top 0.3: OQ3.2 25.85,62.42 24.61,61.19 17.32,61.19 OD3.A 17.19,61.19 15.54,61.19 11.69,65.04 6.88,65.04 XO.6
N$2
  Top 0.3: 63.52,7.56 61.05,10.04 PF1.1 | 63.52,7.56 PD1.C 63.52,7.56 | 63.52,7.56 60.09,4.12 PFJ1.1
N$3
  Top 0.3: OQ1.2 25.57,88.41 17.05,88.41 OD1.A 16.91,88.28 14.03,85.39 6.88,85.39 XO.2
N$4
  Top 0.3: OQ2.2 25.57,75.49 24.06,73.97 17.05,73.97 OD2.A 16.91,73.97 15.81,75.08 6.88,75.08 XO.4
N$6
  Top 0.3: EC2.1 52.25,28.88 54.59,28.88 55.96,30.25 ER4.1 56.1,30.39 60.23,30.39 ER3.1
N$7
  Top 0.3: PD1.A 67.92,7.42 77.96,7.42 80.99,4.4 PJ1.VIN0
N$9
  Top 0.3: ER8.2 76.31,46.75 51.01,46.75 42.9,38.64 42.9,37.81 43.17,37.54 44,37.54 ENC.27
N$11
  Top 0.3: PLED1.A 59.95,16.5 PR1.1
N$12
  Top 0.3: PC2.2 42.21,4.26 45.24,7.29 47.02,7.29 51.01,11.28 51.01,12.65 PIC2.2 51.01,12.93 49.91,14.03 49.91,23.1 PIC1.3
N$13
  Top 0.3: ENC.1 36.85,38.23 36.02,38.23 31.07,43.17 EC3.+
N$14  (via drill 0.5)
  Top 0.3: ENC.26 44.17,36.98 45.04,36.98 45.57,37.5 v45.75,37.5 | v62.25,48 74.6,48 ER9.2
  Bottom 0.3: v62.25,48 48.84,48 45.75,44.91 v45.75,37.5
N$17  (via drill 0.5)
  Top 0.3: ER6.1 33.15,30.5 v34.5,30.5 | v34.5,32.75 34.88,32.38 ENC.10
  Bottom 0.3: v34.5,30.5 v34.5,32.75
N$19
  Top 0.3: ER5.1 33.96,28.6 35.75,28.6 36.85,29.7 ENC.14
N$22
  Top 0.3: Q2.1 50.46,41.94 50.46,36.85 EC5.1 50.33,36.71 49.23,35.61 44.14,35.61 ENC.24
N$24
  Top 0.3: ENC.23 44.14,34.92 45.1,34.92 45.92,34.1 50.33,34.1 EC4.1 50.33,34.24 51.15,35.06 51.15,37.4 55.41,41.66 55.41,41.94 Q2.2
RAW_IV
  Top 0.3: OD1.C 16.91,92.54 8.94,92.54 6.88,90.47 XO.1 6.74,90.34 6.74,88.41 4.26,85.94 4.26,82.78 6.74,80.3 XO.3 6.88,80.16 7.77,79.27 | 7.77,79.27 8.8,78.24 16.91,78.24 OD2.C | PC3.2 51.29,3.85 51.29,7.97 51.15,8.11 PIC2.1 51.42,7.97 53.35,9.9 55.96,9.9 PF1.2 | PFJ1.2 57.48,3.99 51.42,3.99 PC3.2 | OD3.C 17.19,65.45 12.1,65.45 7.42,70.12 6.88,70.12 XO.5 | XO.5 6.88,69.99 4.26,67.38 4.26,64.49 7.01,61.74 7.01,32.04 XI.1 7.01,31.9 4.54,29.43 4.54,5.91 7.84,2.61 50.19,2.61 51.29,3.71 PC3.2 | 7.77,79.27 7.7,79.2 4.26,75.76 4.26,72.74 6.74,70.26 XO.5
RD+  (via drill 0.5)
  Top 0.3: v65.04,34.51 62.84,36.71 55.27,36.71 55,36.44 55,35.2 55.96,34.24 55.96,32.17 ER4.2 55.83,32.17 55.41,32.17 55,31.76 v54.59,31.76 | v41.94,30.39 36.99,30.39 ENC.13
  Bottom 0.3: v65.04,34.51 66,33.55 68.89,33.55 U$2.RD+ | v41.94,30.39 46.75,30.39 48.95,28.19 51.01,28.19 v54.59,31.76
RD-  (via drill 0.5)
  Top 0.3: U$2.RD- 66.55,37.12 69.3,37.12 70.12,36.3 70.12,30.52 69.3,29.7 67.38,29.7 65.04,32.04 60.36,32.04 ER3.2 60.23,32.04 59.54,31.35 v58.99,31.35 | v39.74,31.35 39.46,31.07 36.99,31.07 ENC.12
  Bottom 0.3: v39.74,31.35 43.45,27.64 55.27,27.64 v58.99,31.35
RX
  Bottom 0.3: PP.4 11.55,52.66 49.5,52.66 62.56,65.72 MC.RX1$1
TD+
  Top 0.3: 66.83,33.27 65.04,33.27 62.56,35.75 60.36,35.75 ER2.1 | 66.83,33.27 68.89,31.21 68.89,30.94 U$2.TD+ | ENC.17 44.14,31.07 47.99,31.07 49.91,33 52.8,33 53.9,34.1 53.9,37.12 58.99,42.21 61.05,42.21 65.31,37.95 65.31,36.71 66.28,35.75 66.96,35.75 67.51,35.2 67.51,34.1 66.83,33.41 66.83,33.27
TD-
  Top 0.3: 57.06,35.75 58.71,35.75 61.88,32.59 66,32.59 66.41,32.17 U$2.TD- | 57.06,35.75 56.1,35.75 ER1.1 | ENC.16 44.14,30.39 48.67,30.39 48.95,30.11 54.17,30.11 55.41,31.35 56.79,31.35 57.06,31.62 57.06,35.61 57.06,35.75
TX
  Bottom 0.3: PP.3 11.55,50.05 49.36,50.05 62.56,63.25 MC.TX0$1

### Text on the board
tPlace: IOTECH © 2018 | IOTB v0.4 TOP | S/N: | www.iotech.com.tr
bPlace: IOTECH | IOTB BOT